# EAGLE schematic Hammond_1551V4 (EAGLE 7.4.0)
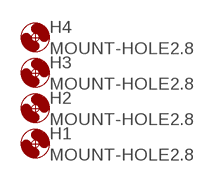
[diagram p0: schematic, sheet 1]

## Parts
H1  MOUNT-HOLE2.8  [2,8]
H2  MOUNT-HOLE2.8  [2,8]
H3  MOUNT-HOLE2.8  [2,8]
H4  MOUNT-HOLE2.8  [2,8]

## Library data of the parts
H1-H4 = holes:MOUNT-HOLE: MOUNTING HOLE with drill center marker